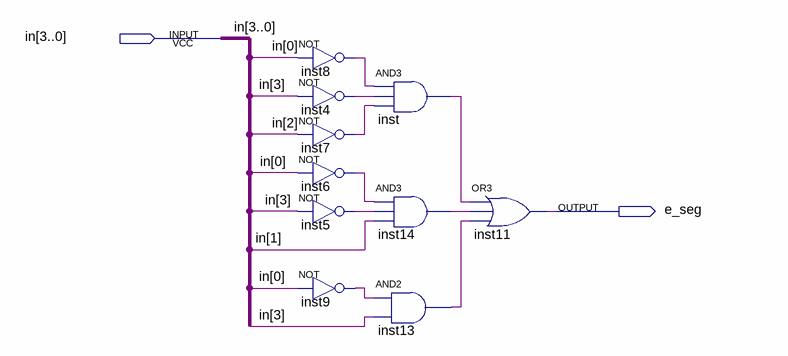
[diagram p0: schematic sheet]
// Quartus schematic e_seg_old.bdf as structural Verilog: 10 symbols, 2 pins
module e_seg_old (
  input  [3:0] in,
  output e_seg
);

  wire inst4_out, inst5_out, inst6_out, inst7_out, inst8_out, inst9_out, inst13_out, inst14_out, inst_out;

  not inst8 (inst8_out, in[0]);
  not inst4 (inst4_out, in[3]);
  not inst7 (inst7_out, in[2]);
  not inst6 (inst6_out, in[0]);
  not inst5 (inst5_out, in[3]);
  not inst9 (inst9_out, in[0]);
  and inst (inst_out, inst8_out, inst4_out, inst7_out);
  and inst14 (inst14_out, inst6_out, inst5_out, in[1]);
  and inst13 (inst13_out, inst9_out, in[3]);
  or inst11 (e_seg, inst_out, inst14_out, inst13_out);
endmodule
